# Altium schematic sheet EG8010.SchDoc
size A4; SheetNumber: 4; SheetTotal: 4
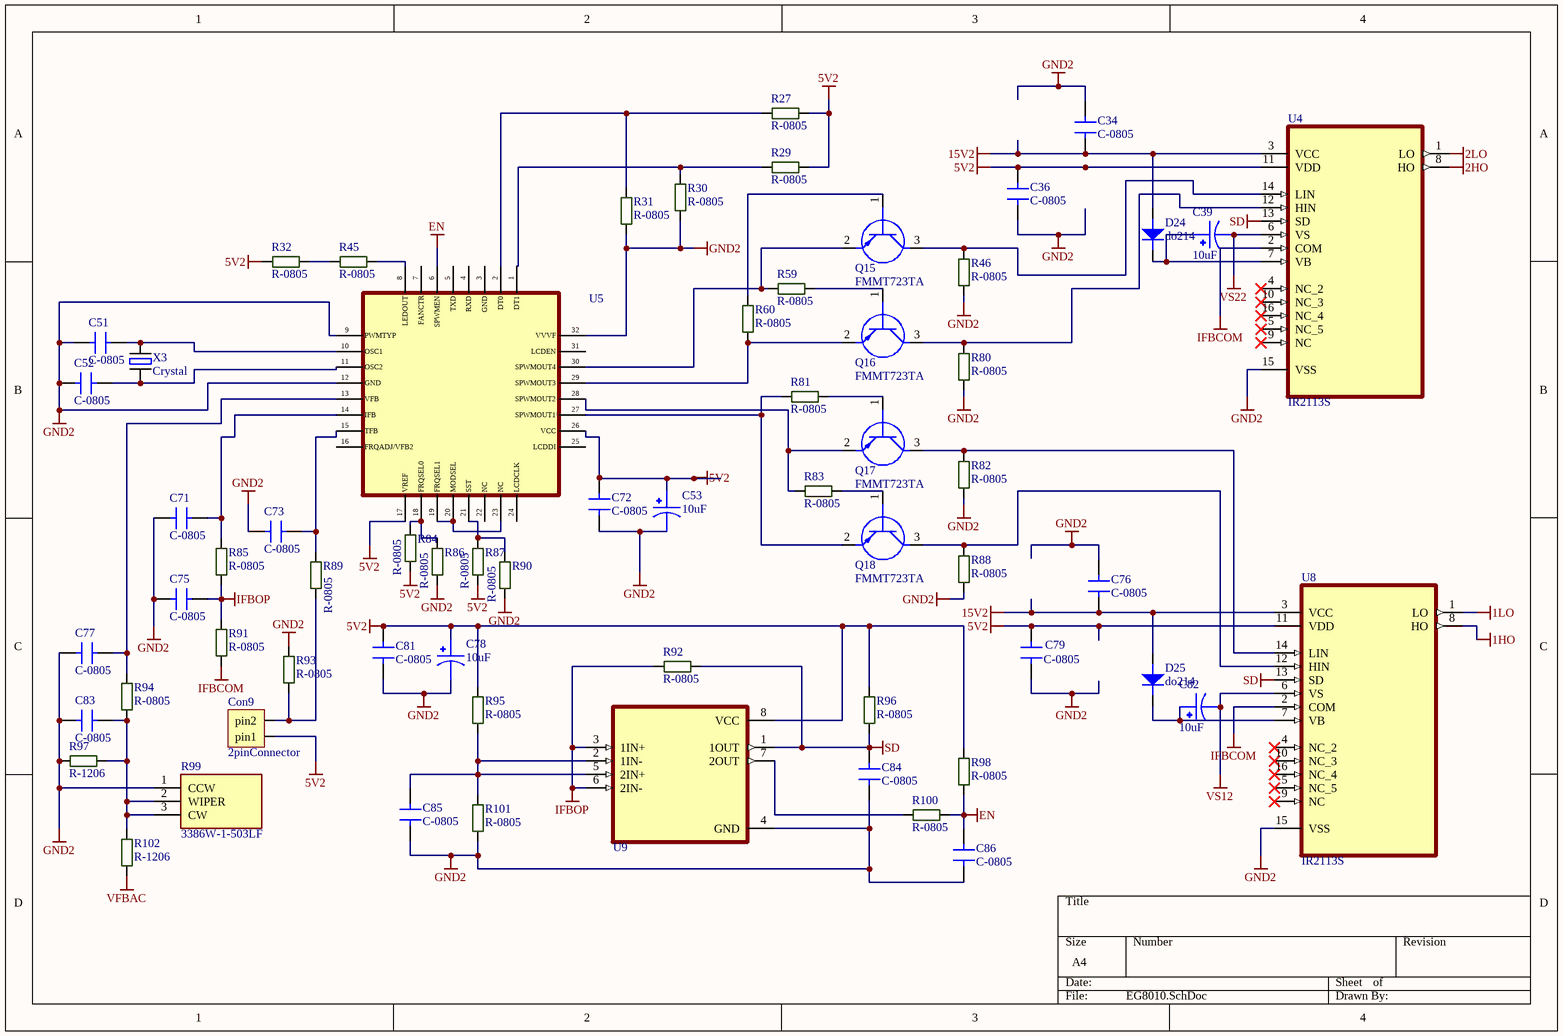
[diagram p0: EG8010.SchDoc]

## Parts
C34  C-0805  [C-0805W]
C36  C-0805  [C-0805W]
C39  10uF  [CapSmdElc]
C51  C-0805  [C-0805W]
C52  C-0805  [C-0805W]
C53  10uF  [CapSmdElc]
C71  C-0805  [C-0805W]
C72  C-0805  [C-0805W]
C73  C-0805  [C-0805W]
C75  C-0805  [C-0805W]
C76  C-0805  [C-0805W]
C77  C-0805  [C-0805W]
C78  10uF  [CapSmdElc]
C79  C-0805  [C-0805W]
C81  C-0805  [C-0805W]
C82  10uF  [CapSmdElc]
C83  C-0805  [C-0805W]
C84  C-0805  [C-0805W]
C85  C-0805  [C-0805W]
C86  C-0805  [C-0805W]
Con9  2pinConnector  [2pinCon]
D24  do214  [DO-214AC]
D25  do214  [DO-214AC]
Q15  FMMT723TA  [SOT96P240X100-3N]
Q16  FMMT723TA  [SOT96P240X100-3N]
Q17  FMMT723TA  [SOT96P240X100-3N]
Q18  FMMT723TA  [SOT96P240X100-3N]
R27  R-0805  [R-0805W]
R29  R-0805  [R-0805W]
R30  R-0805  [R-0805W]
R31  R-0805  [R-0805W]
R32  R-0805  [R-0805W]
R45  R-0805  [R-0805W]
R46  R-0805  [R-0805W]
R59  R-0805  [R-0805W]
R60  R-0805  [R-0805W]
R80  R-0805  [R-0805W]
R81  R-0805  [R-0805W]
R82  R-0805  [R-0805W]
R83  R-0805  [R-0805W]
R84  R-0805  [R-0805W]
R85  R-0805  [R-0805W]
R86  R-0805  [R-0805W]
R87  R-0805  [R-0805W]
R88  R-0805  [R-0805W]
R89  R-0805  [R-0805W]
R90  R-0805  [R-0805W]
R91  R-0805  [R-0805W]
R92  R-0805  [R-0805W]
R93  R-0805  [R-0805W]
R94  R-0805  [R-0805W]
R95  R-0805  [R-0805W]
R96  R-0805  [R-0805W]
R97  R-1206  [R-1206W]
R98  R-0805  [R-0805W]
R99  3386W-1-503LF  [3386W]
R100  R-0805  [R-0805W]
R101  R-0805  [R-0805W]
R102  R-1206  [R-1206W]
U4  IR2113S  [SOIC127P1032X265-16N]
U5  EG8010  [EG8010]  (value not drawn)
U8  IR2113S  [SOIC127P1032X265-16N]
U9  LM393D  [SOIC127P600X175-8N]  (value not drawn)
X3  Crystal  [crystal]

## Nets
1HO: U8.8(HO)
1LO: U8.1(LO)
2HO: U4.8(HO)
2LO: U4.1(LO)
5V2: C36.2 C53.1 C72.2 C78.1 C79.2 C81.2 Con9.1(pin1) R27.2 R29.2 R32.1 R84.1 R87.1 R95.2 R96.2 R98.1 U4.11(VDD) U5.17(VREF) U5.26(VCC) U8.11(VDD) U9.8(VCC)
15V2: C34.2 C76.2 D24.a D25.a U4.3(VCC) U8.3(VCC)
EN: C86.2 R98.2 R100.1 U5.6(SPWMEN)
GND2: C34.1 C36.1 C51.1 C52.1 C53.2 C71.1 C72.1 C73.1 C75.1 C76.1 C77.1 C78.2 C79.1 C81.1 C83.1 C84.1 C85.1 C86.1 R30.1 R31.1 R46.2 R80.2 R82.2 R86.1 R88.2 R90.1 R93.2 R97.2 R99.1(CCW) R101.1 U4.15(VSS) U5.9(PWMTYP) U5.12(GND) U5.32(VVVF) U8.15(VSS) U9.4(GND)
IFBCOM: R91.1 U4.2(COM) U8.2(COM)
IFBOP: C75.2 R85.1 R91.2 R92.1 U9.3(1IN+) U9.6(2IN-)
SD: C84.2 R92.2 R96.1 U4.13(SD) U8.13(SD) U9.1(1OUT)
VFBAC: R102.1
VS12: C82.2 U8.6(VS)
VS22: C39.2 U4.6(VS)
NetC39_1: C39.1 D24.k U4.7(VB)
NetC51_2: C51.2 U5.10(OSC1) X3.1
NetC52_2: C52.2 U5.11(OSC2) X3.2
NetC71_2: C71.2 R85.2 U5.14(IFB)
NetC73_2: C73.2 R89.2 U5.15(TFB)
NetC77_2: C77.2 R94.2 U5.13(VFB)
NetC82_1: C82.1 D25.k U8.7(VB)
NetC83_2: C83.2 R94.1 R97.1 R99.2(WIPER) R99.3(CW) R102.2
NetC85_2: C85.2 R95.1 R101.2 U9.2(1IN-) U9.5(2IN+)
NetCon9_2: Con9.2(pin2) R89.1 R93.1
NetQ15_1: Q15.1(B) R60.2
NetQ15_2: Q15.2(E) R59.2 U5.30(SPWMOUT4)
NetQ15_3: Q15.3(C) R46.1 U4.14(LIN)
NetQ16_1: Q16.1(B) R59.1
NetQ16_2: Q16.2(E) R60.1 U5.29(SPWMOUT3)
NetQ16_3: Q16.3(C) R80.1 U4.12(HIN)
NetQ17_1: Q17.1(B) R81.1
NetQ17_2: Q17.2(E) R83.2 U5.28(SPWMOUT2)
NetQ17_3: Q17.3(C) R82.1 U8.14(LIN)
NetQ18_1: Q18.1(B) R83.1
NetQ18_2: Q18.2(E) R81.2 U5.27(SPWMOUT1)
NetQ18_3: Q18.3(C) R88.1 U8.12(HIN)
NetR27_1: R27.1 R31.2 U5.2(DT0)
NetR29_1: R29.1 R30.2 U5.1(DT1)
NetR32_2: R32.2 R45.1
NetR45_2: R45.2 U5.8(LEDOUT)
NetR84_2: R84.2 R86.2 U5.18(FRQSEL0)
NetR87_2: R87.2 R90.2 U5.21(SST)
NetR100_2: R100.2 U9.7(2OUT)
NetU5_19: U5.19(FRQSEL1) U5.20(MODSEL) U5.23(NC)

Not connected (* = marked no-connect by the designer): U4 4(NC_2)* 5(NC_5)* 9(NC)* 10(NC_3)* 16(NC_4)*; U5 3(GND) 4(RXD) 5(TXD) 7(FANCTR) 16(FRQADJ/VFB2) 22(NC) 24(LCDCLK) 25(LCDDI) 31(LCDEN); U8 4(NC_2)* 5(NC_5)* 9(NC)* 10(NC_3)* 16(NC_4)*

## Library data of the parts
C39 C53 C78 C82 = 100 uF Electr Cap
D24 D25 = do214: DIODE FAST SWITCHING Single 150mA 75V SMT SOD323
Q15-Q18 = FMMT723TA: Transistor BJT PNP; Manufacturer_Name: Diodes Inc.; Datasheet Link: https://componentsearchengine.com/Datasheets/2/FMMT723TA.pdf; Height: 1mm; Manufacturer_Part_Number: FMMT723TA; Mouser Part Number: 522-FMMT723TA; Mouser Price/Stock: https://www.mouser.co.uk/ProductDetail/Diodes-Incorporated/FMMT723TA?qs=MQZxQ7B7MZKu7Wrs0zY3fA%3D%3D; Arrow Part Number: FMMT723TA; Arrow Price/Stock: https://www.arrow.com/en/products/fmmt723ta/diodes-incorporated
R99 = 3386W-1-503LF: Resistor; Manufacturer_Name: Bourns; Datasheet Link: http://www.bourns.com/docs/Product-Datasheets/3386.pdf; Manufacturer_Part_Number: 3386W-1-503LF; Mouser Part Number: 652-3386W-1-503LF; Mouser Price/Stock: https://www.mouser.co.uk/ProductDetail/Bourns/3386W-1-503LF?qs=aZhnFHiXcUS20GqScAFfrw%3D%3D; Arrow Part Number: 3386W-1-503LF; Arrow Price/Stock: https://www.arrow.com/en/products/3386w-1-503lf/bourns
U4 U8 = IR2113S: Half-Bridge Gate Driver IC Non-Inverting 16-SOIC; MF: Infineon Technologies; Value: *; SnapEDA_Link: https://www.snapeda.com/parts/IR2113S/Infineon%20Technologies/view-part/577803/?ref=snap; Package: SOIC-16 Infineon; MP: IR2113S; Availability: Unavailable; Price: None
U5 = EG8010: EG8010 is a CMOS IC that integrates SPWM sinusoid generator, dead / time control circuit, range divider，soft start circuit, circuit protection, RS232 serial communication, / 12832 serial LCD unit, and etc.
U9 = LM393D: Dual differential comparator, commercial grade 8-SOIC 0 to 70; MF: Texas Instruments; SnapEDA_Link: https://www.snapeda.com/parts/LM393D/Texas%20Instruments/view-part/4806035/?ref=snap; Package: SOIC-8 Texas Instruments; Availability: Good; Value: *; MP: LM393D; Mouser-Purchase-URL: https://snapeda.com/shop?store=Mouser&id=4806035; Arrow_Electronics-Purchase-URL: https://snapeda.com/shop?store=Arrow+Electronics&id=4806035; Price: None; Texas_Instruments-Purchase-URL: https://snapeda.com/shop?store=Texas+Instruments&id=4806035; BuyPart: https://www.snapeda.com/parts/LM393D/Texas%20Instruments/view-part/4806035/?ref=eda
X3 = Crystal: AS49SD-16M-FC160F3-TR